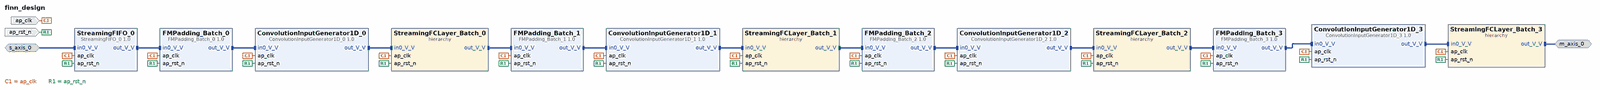
[diagram p0: block diagram of the top level, whole]
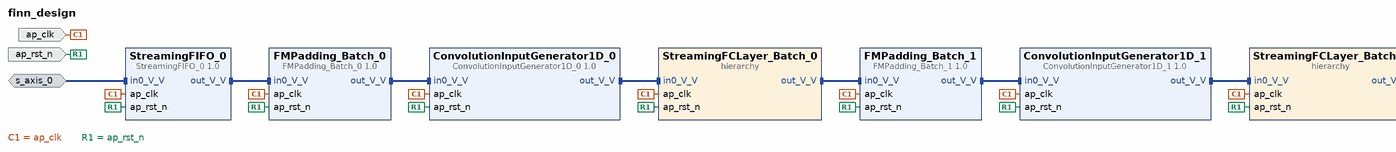
[diagram p1: block diagram of the top level, left part]
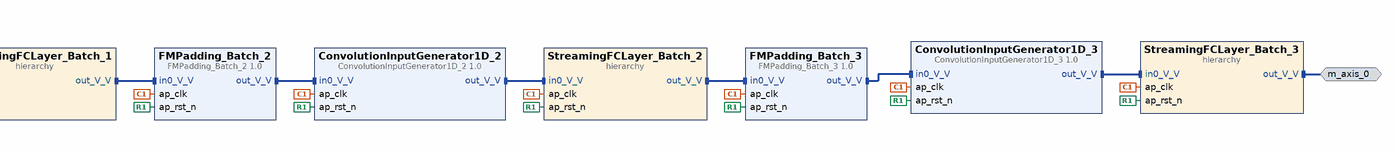
[diagram p2: block diagram of the top level, right part]
# Vivado block design finn_design, xc7a200tfbg484-3, Vivado 2019.1
create_bd_design finn_design

create_bd_intf_port -mode Slave -vlnv xilinx.com:interface:axis_rtl:1.0 s_axis_0
set_property -dict [list \
  CONFIG.FREQ_HZ 100000000.000000 \
  CONFIG.HAS_TKEEP 0 \
  CONFIG.HAS_TLAST 0 \
  CONFIG.HAS_TREADY 1 \
  CONFIG.HAS_TSTRB 0 \
  CONFIG.LAYERED_METADATA undef \
  CONFIG.TDATA_NUM_BYTES 1 \
  CONFIG.TDEST_WIDTH 0 \
  CONFIG.TID_WIDTH 0 \
  CONFIG.TUSER_WIDTH 0 \
] [get_bd_intf_ports s_axis_0]
create_bd_intf_port -mode Master -vlnv xilinx.com:interface:axis_rtl:1.0 m_axis_0
set_property -dict {CONFIG.FREQ_HZ 100000000.000000} [get_bd_intf_ports m_axis_0]
create_bd_port -dir I -type clk ap_clk
set_property -dict {CONFIG.FREQ_HZ 100000000.000000} [get_bd_ports ap_clk]
create_bd_port -dir I -type rst ap_rst_n

create_bd_cell -type ip -vlnv xilinx.com:hls:StreamingFIFO_0:1.0 StreamingFIFO_0
create_bd_cell -type ip -vlnv xilinx.com:hls:FMPadding_Batch_0:1.0 FMPadding_Batch_0
create_bd_cell -type ip -vlnv xilinx.com:hls:ConvolutionInputGenerator1D_0:1.0 ConvolutionInputGenerator1D_0
create_bd_cell -type hier StreamingFCLayer_Batch_0
create_bd_cell -type ip -vlnv xilinx.com:hls:FMPadding_Batch_1:1.0 FMPadding_Batch_1
create_bd_cell -type ip -vlnv xilinx.com:hls:ConvolutionInputGenerator1D_1:1.0 ConvolutionInputGenerator1D_1
create_bd_cell -type hier StreamingFCLayer_Batch_1
create_bd_cell -type ip -vlnv xilinx.com:hls:FMPadding_Batch_2:1.0 FMPadding_Batch_2
create_bd_cell -type ip -vlnv xilinx.com:hls:ConvolutionInputGenerator1D_2:1.0 ConvolutionInputGenerator1D_2
create_bd_cell -type hier StreamingFCLayer_Batch_2
create_bd_cell -type ip -vlnv xilinx.com:hls:FMPadding_Batch_3:1.0 FMPadding_Batch_3
create_bd_cell -type ip -vlnv xilinx.com:hls:ConvolutionInputGenerator1D_3:1.0 ConvolutionInputGenerator1D_3
create_bd_cell -type hier StreamingFCLayer_Batch_3

# ---- hierarchy /StreamingFCLayer_Batch_0 ----
current_bd_instance /StreamingFCLayer_Batch_0
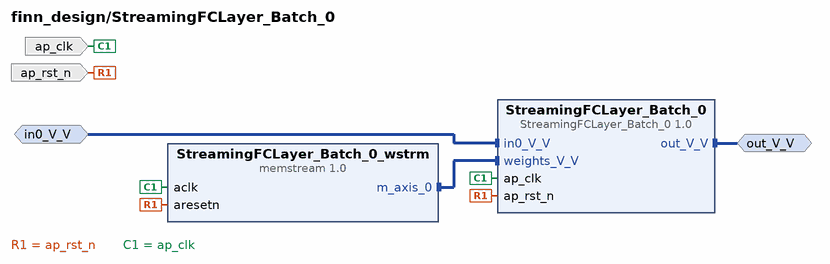
[diagram p3: block diagram inside /StreamingFCLayer_Batch_0]
create_bd_intf_pin -mode Master -vlnv xilinx.com:interface:axis_rtl:1.0 out_V_V
create_bd_intf_pin -mode Slave -vlnv xilinx.com:interface:axis_rtl:1.0 in0_V_V
create_bd_pin -dir I -type clk ap_clk
create_bd_pin -dir I -type rst ap_rst_n

create_bd_cell -type ip -vlnv xilinx.com:hls:StreamingFCLayer_Batch_0:1.0 StreamingFCLayer_Batch_0
create_bd_cell -type ip -vlnv xilinx.com:user:memstream:1.0 StreamingFCLayer_Batch_0_wstrm
set_property -dict [list \
  CONFIG.MEM_DEPTH 1 \
  CONFIG.MEM_INIT /tmp/finn_dev_jokar/code_gen_ipgen_StreamingFCLayer_Batch_0_r2l81l2y/ \
  CONFIG.MEM_WIDTH 96 \
  CONFIG.NSTREAMS 1 \
  CONFIG.RAM_STYLE auto \
  CONFIG.STRM0_DEPTH 1 \
  CONFIG.STRM0_OFFSET 0 \
  CONFIG.STRM0_WIDTH 96 \
] [get_bd_cells StreamingFCLayer_Batch_0_wstrm]

# ---- hierarchy /StreamingFCLayer_Batch_1 ----
current_bd_instance /StreamingFCLayer_Batch_1
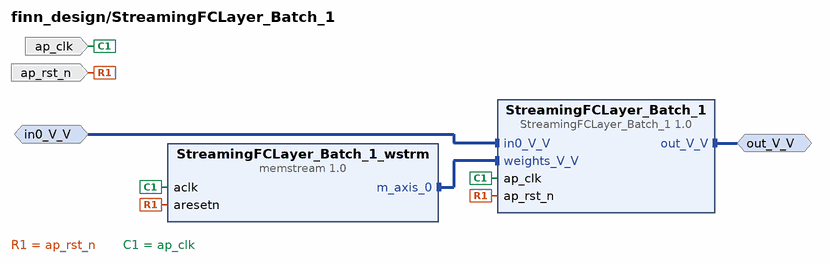
[diagram p4: block diagram inside /StreamingFCLayer_Batch_1]
create_bd_intf_pin -mode Master -vlnv xilinx.com:interface:axis_rtl:1.0 out_V_V
create_bd_intf_pin -mode Slave -vlnv xilinx.com:interface:axis_rtl:1.0 in0_V_V
create_bd_pin -dir I -type clk ap_clk
create_bd_pin -dir I -type rst ap_rst_n

create_bd_cell -type ip -vlnv xilinx.com:hls:StreamingFCLayer_Batch_1:1.0 StreamingFCLayer_Batch_1
create_bd_cell -type ip -vlnv xilinx.com:user:memstream:1.0 StreamingFCLayer_Batch_1_wstrm
set_property -dict [list \
  CONFIG.MEM_DEPTH 1 \
  CONFIG.MEM_INIT /tmp/finn_dev_jokar/code_gen_ipgen_StreamingFCLayer_Batch_1_jyi0q7y_/ \
  CONFIG.MEM_WIDTH 768 \
  CONFIG.NSTREAMS 1 \
  CONFIG.RAM_STYLE auto \
  CONFIG.STRM0_DEPTH 1 \
  CONFIG.STRM0_OFFSET 0 \
  CONFIG.STRM0_WIDTH 768 \
] [get_bd_cells StreamingFCLayer_Batch_1_wstrm]

# ---- hierarchy /StreamingFCLayer_Batch_2 ----
current_bd_instance /StreamingFCLayer_Batch_2
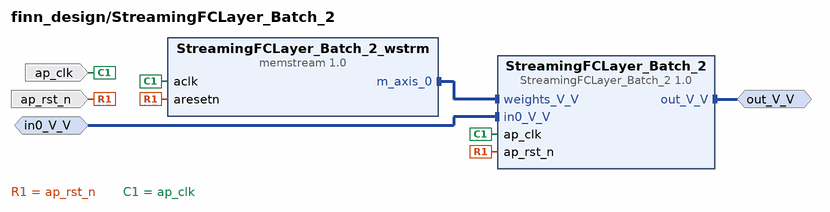
[diagram p5: block diagram inside /StreamingFCLayer_Batch_2]
create_bd_intf_pin -mode Master -vlnv xilinx.com:interface:axis_rtl:1.0 out_V_V
create_bd_intf_pin -mode Slave -vlnv xilinx.com:interface:axis_rtl:1.0 in0_V_V
create_bd_pin -dir I -type clk ap_clk
create_bd_pin -dir I -type rst ap_rst_n

create_bd_cell -type ip -vlnv xilinx.com:hls:StreamingFCLayer_Batch_2:1.0 StreamingFCLayer_Batch_2
create_bd_cell -type ip -vlnv xilinx.com:user:memstream:1.0 StreamingFCLayer_Batch_2_wstrm
set_property -dict [list \
  CONFIG.MEM_DEPTH 1 \
  CONFIG.MEM_INIT /tmp/finn_dev_jokar/code_gen_ipgen_StreamingFCLayer_Batch_2_aqd1y8fw/ \
  CONFIG.MEM_WIDTH 768 \
  CONFIG.NSTREAMS 1 \
  CONFIG.RAM_STYLE auto \
  CONFIG.STRM0_DEPTH 1 \
  CONFIG.STRM0_OFFSET 0 \
  CONFIG.STRM0_WIDTH 768 \
] [get_bd_cells StreamingFCLayer_Batch_2_wstrm]

# ---- hierarchy /StreamingFCLayer_Batch_3 ----
current_bd_instance /StreamingFCLayer_Batch_3
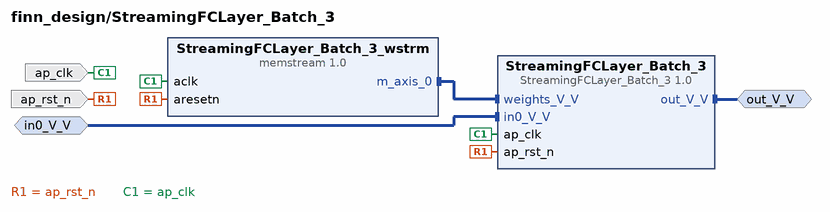
[diagram p6: block diagram inside /StreamingFCLayer_Batch_3]
create_bd_intf_pin -mode Master -vlnv xilinx.com:interface:axis_rtl:1.0 out_V_V
create_bd_intf_pin -mode Slave -vlnv xilinx.com:interface:axis_rtl:1.0 in0_V_V
create_bd_pin -dir I -type clk ap_clk
create_bd_pin -dir I -type rst ap_rst_n

create_bd_cell -type ip -vlnv xilinx.com:hls:StreamingFCLayer_Batch_3:1.0 StreamingFCLayer_Batch_3
create_bd_cell -type ip -vlnv xilinx.com:user:memstream:1.0 StreamingFCLayer_Batch_3_wstrm
set_property -dict [list \
  CONFIG.MEM_DEPTH 1 \
  CONFIG.MEM_INIT /tmp/finn_dev_jokar/code_gen_ipgen_StreamingFCLayer_Batch_3_lw7df92t/ \
  CONFIG.MEM_WIDTH 96 \
  CONFIG.NSTREAMS 1 \
  CONFIG.RAM_STYLE auto \
  CONFIG.STRM0_DEPTH 1 \
  CONFIG.STRM0_OFFSET 0 \
  CONFIG.STRM0_WIDTH 96 \
] [get_bd_cells StreamingFCLayer_Batch_3_wstrm]

# ---- connections ----

current_bd_instance /StreamingFCLayer_Batch_0
connect_bd_intf_net [get_bd_intf_pins in0_V_V] [get_bd_intf_pins StreamingFCLayer_Batch_0/in0_V_V]
connect_bd_intf_net [get_bd_intf_pins out_V_V] [get_bd_intf_pins StreamingFCLayer_Batch_0/out_V_V]
connect_bd_intf_net [get_bd_intf_pins StreamingFCLayer_Batch_0_wstrm/m_axis_0] [get_bd_intf_pins StreamingFCLayer_Batch_0/weights_V_V]
connect_bd_net [get_bd_pins ap_rst_n] [get_bd_pins StreamingFCLayer_Batch_0_wstrm/aresetn] [get_bd_pins StreamingFCLayer_Batch_0/ap_rst_n]
connect_bd_net [get_bd_pins ap_clk] [get_bd_pins StreamingFCLayer_Batch_0_wstrm/aclk] [get_bd_pins StreamingFCLayer_Batch_0/ap_clk]

current_bd_instance /StreamingFCLayer_Batch_1
connect_bd_intf_net [get_bd_intf_pins in0_V_V] [get_bd_intf_pins StreamingFCLayer_Batch_1/in0_V_V]
connect_bd_intf_net [get_bd_intf_pins out_V_V] [get_bd_intf_pins StreamingFCLayer_Batch_1/out_V_V]
connect_bd_intf_net [get_bd_intf_pins StreamingFCLayer_Batch_1_wstrm/m_axis_0] [get_bd_intf_pins StreamingFCLayer_Batch_1/weights_V_V]
connect_bd_net [get_bd_pins ap_rst_n] [get_bd_pins StreamingFCLayer_Batch_1_wstrm/aresetn] [get_bd_pins StreamingFCLayer_Batch_1/ap_rst_n]
connect_bd_net [get_bd_pins ap_clk] [get_bd_pins StreamingFCLayer_Batch_1_wstrm/aclk] [get_bd_pins StreamingFCLayer_Batch_1/ap_clk]

current_bd_instance /StreamingFCLayer_Batch_2
connect_bd_intf_net [get_bd_intf_pins StreamingFCLayer_Batch_2_wstrm/m_axis_0] [get_bd_intf_pins StreamingFCLayer_Batch_2/weights_V_V]
connect_bd_intf_net [get_bd_intf_pins in0_V_V] [get_bd_intf_pins StreamingFCLayer_Batch_2/in0_V_V]
connect_bd_intf_net [get_bd_intf_pins out_V_V] [get_bd_intf_pins StreamingFCLayer_Batch_2/out_V_V]
connect_bd_net [get_bd_pins ap_rst_n] [get_bd_pins StreamingFCLayer_Batch_2_wstrm/aresetn] [get_bd_pins StreamingFCLayer_Batch_2/ap_rst_n]
connect_bd_net [get_bd_pins ap_clk] [get_bd_pins StreamingFCLayer_Batch_2_wstrm/aclk] [get_bd_pins StreamingFCLayer_Batch_2/ap_clk]

current_bd_instance /StreamingFCLayer_Batch_3
connect_bd_intf_net [get_bd_intf_pins StreamingFCLayer_Batch_3_wstrm/m_axis_0] [get_bd_intf_pins StreamingFCLayer_Batch_3/weights_V_V]
connect_bd_intf_net [get_bd_intf_pins in0_V_V] [get_bd_intf_pins StreamingFCLayer_Batch_3/in0_V_V]
connect_bd_intf_net [get_bd_intf_pins out_V_V] [get_bd_intf_pins StreamingFCLayer_Batch_3/out_V_V]
connect_bd_net [get_bd_pins ap_rst_n] [get_bd_pins StreamingFCLayer_Batch_3_wstrm/aresetn] [get_bd_pins StreamingFCLayer_Batch_3/ap_rst_n]
connect_bd_net [get_bd_pins ap_clk] [get_bd_pins StreamingFCLayer_Batch_3_wstrm/aclk] [get_bd_pins StreamingFCLayer_Batch_3/ap_clk]

current_bd_instance /
connect_bd_intf_net [get_bd_intf_ports m_axis_0] [get_bd_intf_pins StreamingFCLayer_Batch_3/out_V_V]
connect_bd_intf_net [get_bd_intf_pins ConvolutionInputGenerator1D_3/out_V_V] [get_bd_intf_pins StreamingFCLayer_Batch_3/in0_V_V]
connect_bd_intf_net [get_bd_intf_pins FMPadding_Batch_3/out_V_V] [get_bd_intf_pins ConvolutionInputGenerator1D_3/in0_V_V]
connect_bd_intf_net [get_bd_intf_pins StreamingFCLayer_Batch_2/out_V_V] [get_bd_intf_pins FMPadding_Batch_3/in0_V_V]
connect_bd_intf_net [get_bd_intf_pins ConvolutionInputGenerator1D_2/out_V_V] [get_bd_intf_pins StreamingFCLayer_Batch_2/in0_V_V]
connect_bd_intf_net [get_bd_intf_pins FMPadding_Batch_1/out_V_V] [get_bd_intf_pins ConvolutionInputGenerator1D_1/in0_V_V]
connect_bd_intf_net [get_bd_intf_pins StreamingFCLayer_Batch_1/out_V_V] [get_bd_intf_pins FMPadding_Batch_2/in0_V_V]
connect_bd_intf_net [get_bd_intf_pins FMPadding_Batch_2/out_V_V] [get_bd_intf_pins ConvolutionInputGenerator1D_2/in0_V_V]
connect_bd_intf_net [get_bd_intf_pins ConvolutionInputGenerator1D_1/out_V_V] [get_bd_intf_pins StreamingFCLayer_Batch_1/in0_V_V]
connect_bd_intf_net [get_bd_intf_pins ConvolutionInputGenerator1D_0/out_V_V] [get_bd_intf_pins StreamingFCLayer_Batch_0/in0_V_V]
connect_bd_intf_net [get_bd_intf_pins StreamingFCLayer_Batch_0/out_V_V] [get_bd_intf_pins FMPadding_Batch_1/in0_V_V]
connect_bd_intf_net [get_bd_intf_pins StreamingFIFO_0/out_V_V] [get_bd_intf_pins FMPadding_Batch_0/in0_V_V]
connect_bd_intf_net [get_bd_intf_pins FMPadding_Batch_0/out_V_V] [get_bd_intf_pins ConvolutionInputGenerator1D_0/in0_V_V]
connect_bd_intf_net -intf_net in0_V_V_0_1 [get_bd_intf_ports s_axis_0] [get_bd_intf_pins StreamingFIFO_0/in0_V_V]
connect_bd_net -net ap_clk_0_1 [get_bd_ports ap_clk] \
  [get_bd_pins StreamingFIFO_0/ap_clk] [get_bd_pins FMPadding_Batch_0/ap_clk] \
  [get_bd_pins ConvolutionInputGenerator1D_0/ap_clk] [get_bd_pins StreamingFCLayer_Batch_0/ap_clk] \
  [get_bd_pins FMPadding_Batch_1/ap_clk] [get_bd_pins ConvolutionInputGenerator1D_1/ap_clk] \
  [get_bd_pins StreamingFCLayer_Batch_1/ap_clk] [get_bd_pins FMPadding_Batch_2/ap_clk] \
  [get_bd_pins ConvolutionInputGenerator1D_2/ap_clk] [get_bd_pins StreamingFCLayer_Batch_2/ap_clk] \
  [get_bd_pins FMPadding_Batch_3/ap_clk] [get_bd_pins ConvolutionInputGenerator1D_3/ap_clk] \
  [get_bd_pins StreamingFCLayer_Batch_3/ap_clk]
connect_bd_net -net ap_rst_n_0_1 [get_bd_ports ap_rst_n] \
  [get_bd_pins StreamingFIFO_0/ap_rst_n] [get_bd_pins FMPadding_Batch_0/ap_rst_n] \
  [get_bd_pins ConvolutionInputGenerator1D_0/ap_rst_n] [get_bd_pins StreamingFCLayer_Batch_0/ap_rst_n] \
  [get_bd_pins FMPadding_Batch_1/ap_rst_n] [get_bd_pins ConvolutionInputGenerator1D_1/ap_rst_n] \
  [get_bd_pins StreamingFCLayer_Batch_1/ap_rst_n] [get_bd_pins FMPadding_Batch_2/ap_rst_n] \
  [get_bd_pins ConvolutionInputGenerator1D_2/ap_rst_n] [get_bd_pins StreamingFCLayer_Batch_2/ap_rst_n] \
  [get_bd_pins FMPadding_Batch_3/ap_rst_n] [get_bd_pins ConvolutionInputGenerator1D_3/ap_rst_n] \
  [get_bd_pins StreamingFCLayer_Batch_3/ap_rst_n]

validate_bd_design
save_bd_design
